# EAGLE design PR9011 (EAGLE 7.2.0)
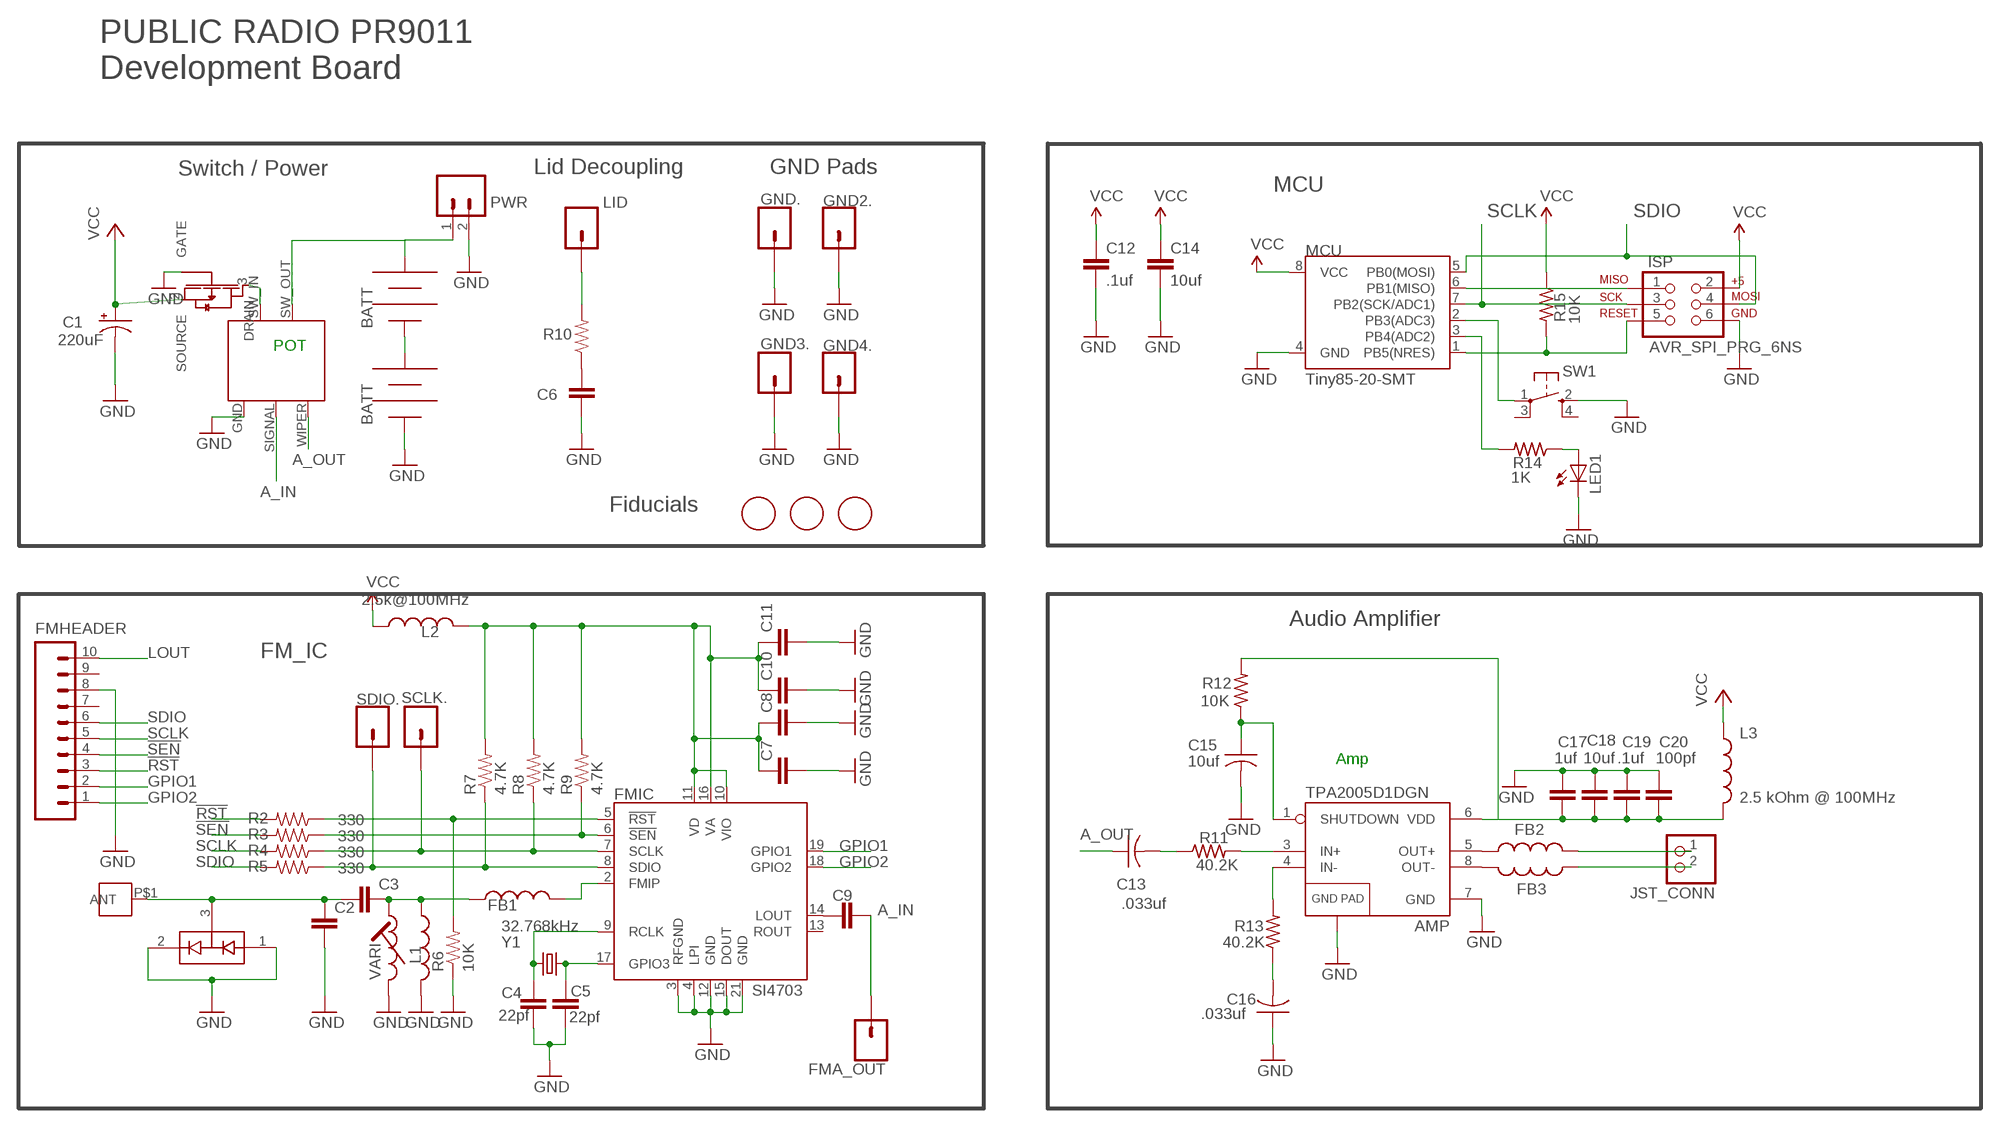
[diagram p0: schematic, sheet 1]

## Parts
AMP  TPA2005D1DGN  [POWER-SOP8]
C1  220uF  CAP_POLC  [PANASONIC_C]
C2  1.0uF  1.0UF-25V-+80/-20(0805)  [0805]
C3  1.0uF  1.0UF-25V-+80/-20(0805)  [0805]
C4  22pf  CAP0805  [0805]
C5  22pf  CAP0805  [0805]
C6  CAP0805  [0805]
C7  1.0uF  1.0UF-25V-+80/-20(0805)  [0805]
C8  .1uF  1.0UF-25V-+80/-20(0805)  [0805]
C9  1.0uF  1.0UF-25V-+80/-20(0805)  [0805]
C10  22nF  1.0UF-25V-+80/-20(0805)  [0805]
C11  4.7uF  1.0UF-25V-+80/-20(0805)  [0805]
C12  .1uf  CAP0805  [0805]
C13  .033uf  C-USC0603  [C0603]
C14  10uf  CAP0805  [0805]
C15  10uf  C-USC0603  [C0603]
C16  .033uf  C-USC0603  [C0603]
C17  1uf  CAP0805  [0805]
C18  10uf  CAP0805  [0805]
C19  .1uf  CAP0805  [0805]
C20  100pf  CAP0805  [0805]
D1  BAV99  [SOT23-3]
FB1  INDUCTOR0805  [0805]
FB2  INDUCTOR0805  [0805]
FB3  INDUCTOR0805  [0805]
FET1  SI2333DDS  [SI2333DDS]
FMA_OUT  M01PTH  [1X01]
FMHEADER  M10LOCK  [1X10_LOCK]
FMIC  SI4703  SPARKFUN_SI470X  [SPARKFUN_SI470X]
GND2.  M01PTH  [1X01]
GND3.  M01PTH  [1X01]
GND4.  M01PTH  [1X01]
GND.  M01PTH  [1X01]
ISP  AVR_SPI_PRG_6NS  [2X3-NS]
J1  M3_SCREW_POST  [M3_SCREW_POST]
JP5  BK-92_MPD_AA_BATT_CLIP  [BK-92_MPD_AA_BATT_CLIP]
JP6  BK-92_MPD_AA_BATT_CLIP  [BK-92_MPD_AA_BATT_CLIP]
JST_CONN  JST_2PIN-SMT-RA  [JST-PH-2-SMT-RA]
L1  INDUCTOR0805  [0805]
L2  2.5k@100MHz  INDUCTOR0603  [0603]
L3  2.5 kOhm @ 100MHz  INDUCTOR0603  [0603]
LED1  LEDSML0603  [SML0603]
LID  M01PTH  [1X01]
MCU  Tiny85-20-SMT  ATTINY45TINY85-20-SMT  [SO08-EIAJ]
PWR  M02PTH3  [1X02_LONGPADS]
R1  RV170SF_TAIWANA_POT_SW  [RV170SF_TAIWANA_POT_SW]
R2  330  RESISTOR0805-RES  [0805]
R3  330  RESISTOR0805-RES  [0805]
R4  330  RESISTOR0805-RES  [0805]
R5  330  RESISTOR0805-RES  [0805]
R6  10K  RESISTOR0805-RES  [0805]
R7  4.7K  RESISTOR0805-RES  [0805]
R8  4.7K  RESISTOR0805-RES  [0805]
R9  4.7K  RESISTOR0805-RES  [0805]
R10  RESISTOR0805-RES  [0805]
R11  40.2K  R-US_R0603  [R0603]
R12  10K  R-US_R0603  [R0603]
R13  40.2K  R-US_R0603  [R0603]
R14  1K  R-US_R0603  [R0603]
R15  10K  R-US_R0603  [R0603]
SCLK.  M01PTH  [1X01]
SDIO.  M01PTH  [1X01]
SW1  SPST_TACT-KMR2  [KMR2]
U$1  FIDUCIAL  [FIDUCIAL_1MM]
U$2  FIDUCIAL  [FIDUCIAL_1MM]
U$4  FIDUCIAL  [FIDUCIAL_1MM]
U$5  CE32A_FOR_JST  [CE32A_FOR_JST]  (not placed on a sheet)
VARI  L-TRIM  [146/150]
Y1  32.768kHz  CRYSTAL32-SMD  [CRYSTAL-32KHZ-SMD]

## Nets
3.3V: C7.1 C8.1 C10.1 C11.1 FMIC.10(VIO) FMIC.11(VD) FMIC.16(VA) L2.2 R7.2 R8.2 R9.2
!RST: FMHEADER.3 R2.2
!RST-L: FMIC.5(!RST) R2.1 R6.2
!SEN: FMHEADER.4 R3.2
!SEN-L: FMIC.6(!SEN) R3.1 R9.1
A_IN: C9.2 FMA_OUT.1 R1.SIGNAL
A_OUT: C13.1 R1.WIPER
GND: AMP.7(GND) AMP.9(GND) C1.- C2.2 C4.2 C5.2 C6.2 C7.2 C8.2 C10.2 C11.2 C12.2 C14.2 C15.2 C16.1 C17.1 C18.1 C19.1 C20.1 D1.1(A1) D1.2(C2) FET1.1(GATE) FMHEADER.8 FMIC.3(RFGND) FMIC.4(LPI) FMIC.12(GND) FMIC.15(DOUT) FMIC.21(GND) GND2..1 GND3..1 GND4..1 GND..1 ISP.6 JP6.NEG JP6.NEG@2(NEG) L1.2 LED1.C MCU.4(GND) PWR.2 R1.GND R6.1 SW1.2(S) VARI.P$1(START)
GPIO1: FMHEADER.2 FMIC.19(GPIO1)
GPIO2: FMHEADER.1 FMIC.18(GPIO2)
LOUT: C9.1 FMHEADER.10 FMIC.14(LOUT)
N$1: C4.1 FMIC.9(RCLK) Y1.X2
N$2: C5.1 FMIC.17(GPIO3) Y1.X1
N$3: C13.2 R11.1
N$4: AMP.3(IN+) R11.2
N$5: AMP.4(IN-) R13.2
N$6: FB1.2 FMIC.2(FMIP)
N$7: LED1.A R14.1
N$8: LID.1 R10.2
N$9: FB2.2 JST_CONN.1
N$11: MCU.2(PB3(ADC3)) SW1.1(P)
N$12: MCU.3(PB4(ADC2)) R14.2
N$13: JP5.NEG JP5.NEG@2(NEG) JP6.POS JP6.POS@2(POS)
N$14 [antenna]: C2.1 C3.1 D1.3(COM) J1.P$1(ANT)
N$15: JP5.POS JP5.POS@2(POS) PWR.1 R1.SW_OUT
N$16 [antenna]: C3.2 FB1.1 L1.1 VARI.P$2(END)
N$17: AMP.8(OUT-) FB3.2
N$18: AMP.6(VDD) C17.2 C18.2 C19.2 C20.2 L3.2 R12.2
N$19: AMP.5(OUT+) FB2.1
N$20: AMP.1(SHUTDOWN) C15.1 R12.1
N$23: C16.2 R13.1
N$34: FET1.3(DRAIN) R1.SW_IN
N$35: C6.1 R10.1
OUT-: FB3.1 JST_CONN.2
PB1: ISP.1 MCU.6(PB1(MISO))
PB5: ISP.5 MCU.1(PB5(NRES)) R15.2
SCLK: FMHEADER.5 ISP.3 MCU.7(PB2(SCK/ADC1)) R4.2
SCLK-L: FMIC.7(SCLK) R4.1 R8.1 SCLK..1
SDIO: FMHEADER.6 ISP.4 MCU.5(PB0(MOSI)) R5.2
SDIO-L: FMIC.8(SDIO) R5.1 R7.1 SDIO..1
VCC: C1.+ C12.1 C14.1 FET1.2(SOURCE) ISP.2 L2.1 L3.1 MCU.8(VCC) R15.1
Unconnected: FMHEADER.7 FMHEADER.9 FMIC.13(ROUT) SW1.3(P1) SW1.4(S1)

## Notes on the sheet
- PUBLIC RADIO PR9011
  Development Board
- Switch / Power | Lid Decoupling | GND Pads
- MCU
- POT
- Fiducials
- Audio Amplifier
- FM_IC
- Amp

## Library data of the parts
AMP = SparkFun-AnalogIC:TPA2005D1: 1.4W MONO CLASS-D AUDIO POWER AMPLIFIER The TPA2005D1 is a 1.4-W high efficiency filter-free class-D audio power amplifier in a BGA, QFN, or MSOP package that requires only three external components. Datasheet: http://focus.ti.com/lit/ds/symlink/tpa2005d1.pdf 1.4 W Into 8 ? From a 5V Supply at THD = 10% (Typ) Maximum Battery Life and Minimum Heat Efficiency With an 8-? Speaker: 84% at 400 mW, 79% at 100 mW 2.8-mA Quiescent Current 0.5-mA Shutdown Current Ideal for Wireless or Cellular Handsets and PDAs Capable of Driving an 8-? Speaker (2.5 V ? VDD ? 5.5 V) and a 4-? Speaker (2.5 V ? VDD ? 4.2 V) Only Three External Components Optimized PWM Output Stage Eliminates LC Output Filter Internally Generated 250-kHz Switching Frequency Eliminates Capacitor and Resistor Improved PSRR (-71 dB at 217 Hz) and Wide Supply Voltage (2.5 V to 5.5 V) Eliminates Need for a Voltage Regulator Fully Differential Design Reduces RF Rectification and Eliminates Bypass Capacitor Improved CMRR Eliminates Two Input Coupling Capacitors
C1 = SparkFun-Passives:CAP_POL: Capacitor Polarized These are standard SMD and PTH capacitors. Normally 10uF, 47uF, and 100uF in electrolytic and tantalum varieties. Always verify the external diameter of the through hole cap, it varies with capacity, voltage, and manufacturer. The EIA devices should be standard.
C2 C3 C7 C9 = SparkFun-Capacitors:1.0UF-25V-+80/-20(0805): CAP-11625; PROD_ID: CAP-11625
C4-C6 C12 C14 C17-C20 = SparkFun-Passives:CAP: Capacitor Standard 0603 ceramic capacitor, and 0.1" leaded capacitor.
C8 C10 C11 = SparkFun-Capacitors:1.0UF-25V-+80/-20(0805): CAP-11625; PROD_ID: CAP-11625; VALUE: 1.0uF
C13 C15 C16 = resistor:C-US: CAPACITOR, American symbol
D1 = SparkFun-DiscreteSemi:BAV99: Two small signal silicon diodes connected anode to cathode. Connections to all three nodes available. DIO-10647; PROD_ID: DIO-10647
FB1-FB3 L1-L3 = SparkFun-Passives:INDUCTOR: Inductors Basic Inductor/Choke - 0603 and 1206. Footprints are not proven and vary greatly between part numbers. SRN6045- 33uH, 20% 1.4A SDR0403-560KL - 56uH, 10%, 500mA RMS/740mA peak
FET1 = PubRadioLib:SI2333DDS
FMA_OUT GND2. GND3. GND4. GND. LID SCLK. SDIO. = SparkFun-Connectors:M01: Header 1 Standard 1-pin 0.1" header. Use with straight break away headers (SKU : PRT-00116), right angle break away headers (PRT-00553), swiss pins (PRT-00743), machine pins (PRT-00117), and female headers (PRT-00115).
FMHEADER = SparkFun-Connectors:M10: Header 10 Standard 10-pin 0.1" header. Use with straight break away headers (SKU : PRT-00116), right angle break away headers (PRT-00553), swiss pins (PRT-00743), machine pins (PRT-00117), and female headers (PRT-00115).
FMIC = FM-Meter-Driver-v11:SPARKFUN_SI470X: Description: This is a powerful FM receiver IC. Tested with Si4703. You really only need SEN, RST, SCLK, and SDIO to get a full FM radio working. Antenna comes from headphone jack. See breakout board on SparkFun website for more information.
ISP = SparkFun-Connectors:AVR_SPI_PRG_6: AVR ISP 6 Pin This is the reduced ISP connector for AVR programming. Common on Arduino. This footprint will take up less PCB space and can be used with a 10-pin to 6-pin adapter such as SKU: BOB-08508 **Special note about "TEST_POINT" package. The stop mask is on the top side, so if you want your programming test points to be on the bottom of your board, make sure to place this package on the bottom side of the board. This also ensure that the orientation to program from the bottom side will be correct.
J1 = PR_Libraries:M3_SCREW_POST
JP5 JP6 = PR_Libraries:BK-92_MPD_AA_BATT_CLIP
JST_CONN = adafruit:JST_2PIN: JST 2-Pin Connectors of various flavors SMT-RA (S2B-PH-SM4) 4UConnector #17311 SMT (B2B-PH-SM4) THM-RA (S2B-PH) THM (B2B-PH)
LED1 = led:LED: LED OSRAM: - CHIPLED LG R971, LG N971, LY N971, LG Q971, LY Q971, LO R971, LY R971 LH N974, LH R974 LS Q976, LO Q976, LY Q976 LO Q996 - Hyper CHIPLED LW Q18S LB Q993, LB Q99A, LB R99A - SideLED LS A670, LO A670, LY A670, LG A670, LP A670 LB A673, LV A673, LT A673, LW A673 LH A674 LY A675 LS A676, LA A676, LO A676, LY A676, LW A676 LS A679, LY A679, LG A679 - Hyper Micro SIDELED® LS Y876, LA Y876, LO Y876, LY Y876 LT Y87S - SmartLED LW L88C, LW L88S LB L89C, LB L89S, LG L890 LS L89K, LO L89K, LY L89K LS L896, LA L896, LO L896, LY L896 - TOPLED LS T670, LO T670, LY T670, LG T670, LP T670 LSG T670, LSP T670, LSY T670, LOP T670, LYG T670 LG T671, LOG T671, LSG T671 LB T673, LV T673, LT T673, LW T673 LH T674 LS T676, LA T676, LO T676, LY T676, LB T676, LH T676, LSB T676, LW T676 LB T67C, LV T67C, LT T67C, LS T67K, LO T67K, LY T67K, LW E67C LS E67B, LA E67B, LO E67B, LY E67B, LB E67C, LV E67C, LT E67C LW T67C LS T679, LY T679, LG T679 LS T770, LO T770, LY T770, LG T770, LP T770 LB T773, LV T773, LT T773, LW T773 LH T774 LS E675, LA E675, LY E675, LS T675 LS T776, LA T776, LO T776, LY T776, LB T776 LHGB T686 LT T68C, LB T68C - Hyper Mini TOPLED® LB M676 - Mini TOPLED Santana® LG M470 LS M47K, LO M47K, LY M47K Source: http://www.osram.convergy.de LUXEON: - LUMILED® LXK2-PW12-R00, LXK2-PW12-S00, LXK2-PW14-U00, LXK2-PW14-V00 LXK2-PM12-R00, LXK2-PM12-S00, LXK2-PM14-U00 LXK2-PE12-Q00, LXK2-PE12-R00, LXK2-PE12-S00, LXK2-PE14-T00, LXK2-PE14-U00 LXK2-PB12-K00, LXK2-PB12-L00, LXK2-PB12-M00, LXK2-PB14-N00, LXK2-PB14-P00, LXK2-PB14-Q00 LXK2-PR12-L00, LXK2-PR12-M00, LXK2-PR14-Q00, LXK2-PR14-R00 LXK2-PD12-Q00, LXK2-PD12-R00, LXK2-PD12-S00 LXK2-PH12-R00, LXK2-PH12-S00 LXK2-PL12-P00, LXK2-PL12-Q00, LXK2-PL12-R00 Source: www.luxeon.com KINGBRIGHT: KA-3528ASYC Source: www.kingbright.com
MCU = SparkFun-DigitalIC:ATTINY45: Atmel 8-pin 2/4/8kB flash uC; PROD_ID: IC-09092
PWR = SparkFun-Connectors:M02: Standard 2-pin 0.1" header. Use with - straight break away headers ( PRT-00116) - right angle break away headers (PRT-00553) - swiss pins (PRT-00743) - machine pins (PRT-00117) - female headers (PRT-00115) Molex polarized connector foot print use with: PRT-08233 with associated crimp pins and housings. 2.54_SCREWTERM for use with PRT-10571. 3.5mm Screw Terminal footprints for PRT-08084 5mm Screw Terminal footprints for use with PRT-08432
R1 = PR_Libraries:RV170SF_TAIWANA_POT_SW
R2-R10 = SparkFun-Passives:RESISTOR: Resistor Basic schematic elements and footprints for 0603, 1206, and PTH resistors.
R11-R15 = resistor:R-US_: RESISTOR, American symbol
SW1 = adafruit:SPST_TACT: SMT 6mm switch, EVQQ2 series http://www.ladyada.net/library/eagle
U$1 U$2 U$4 = adafruit:FIDUCIAL: For use by pick and place machines to calibrate the vision/machine, 1mm By microbuilder.eu
U$5 = PR_Libraries:CE32A_FOR_JST
VARI = coilcraft-trimmer:L-TRIM: Coilcraft 146/150 series trimmer
Y1 = SparkFun:CRYSTAL: Crystals Various standard crystals. Proven footprints. Spark Fun Electronics SKU : COM-00534

## Net classes
1 antenna: clearance 1.27 mm

## Board
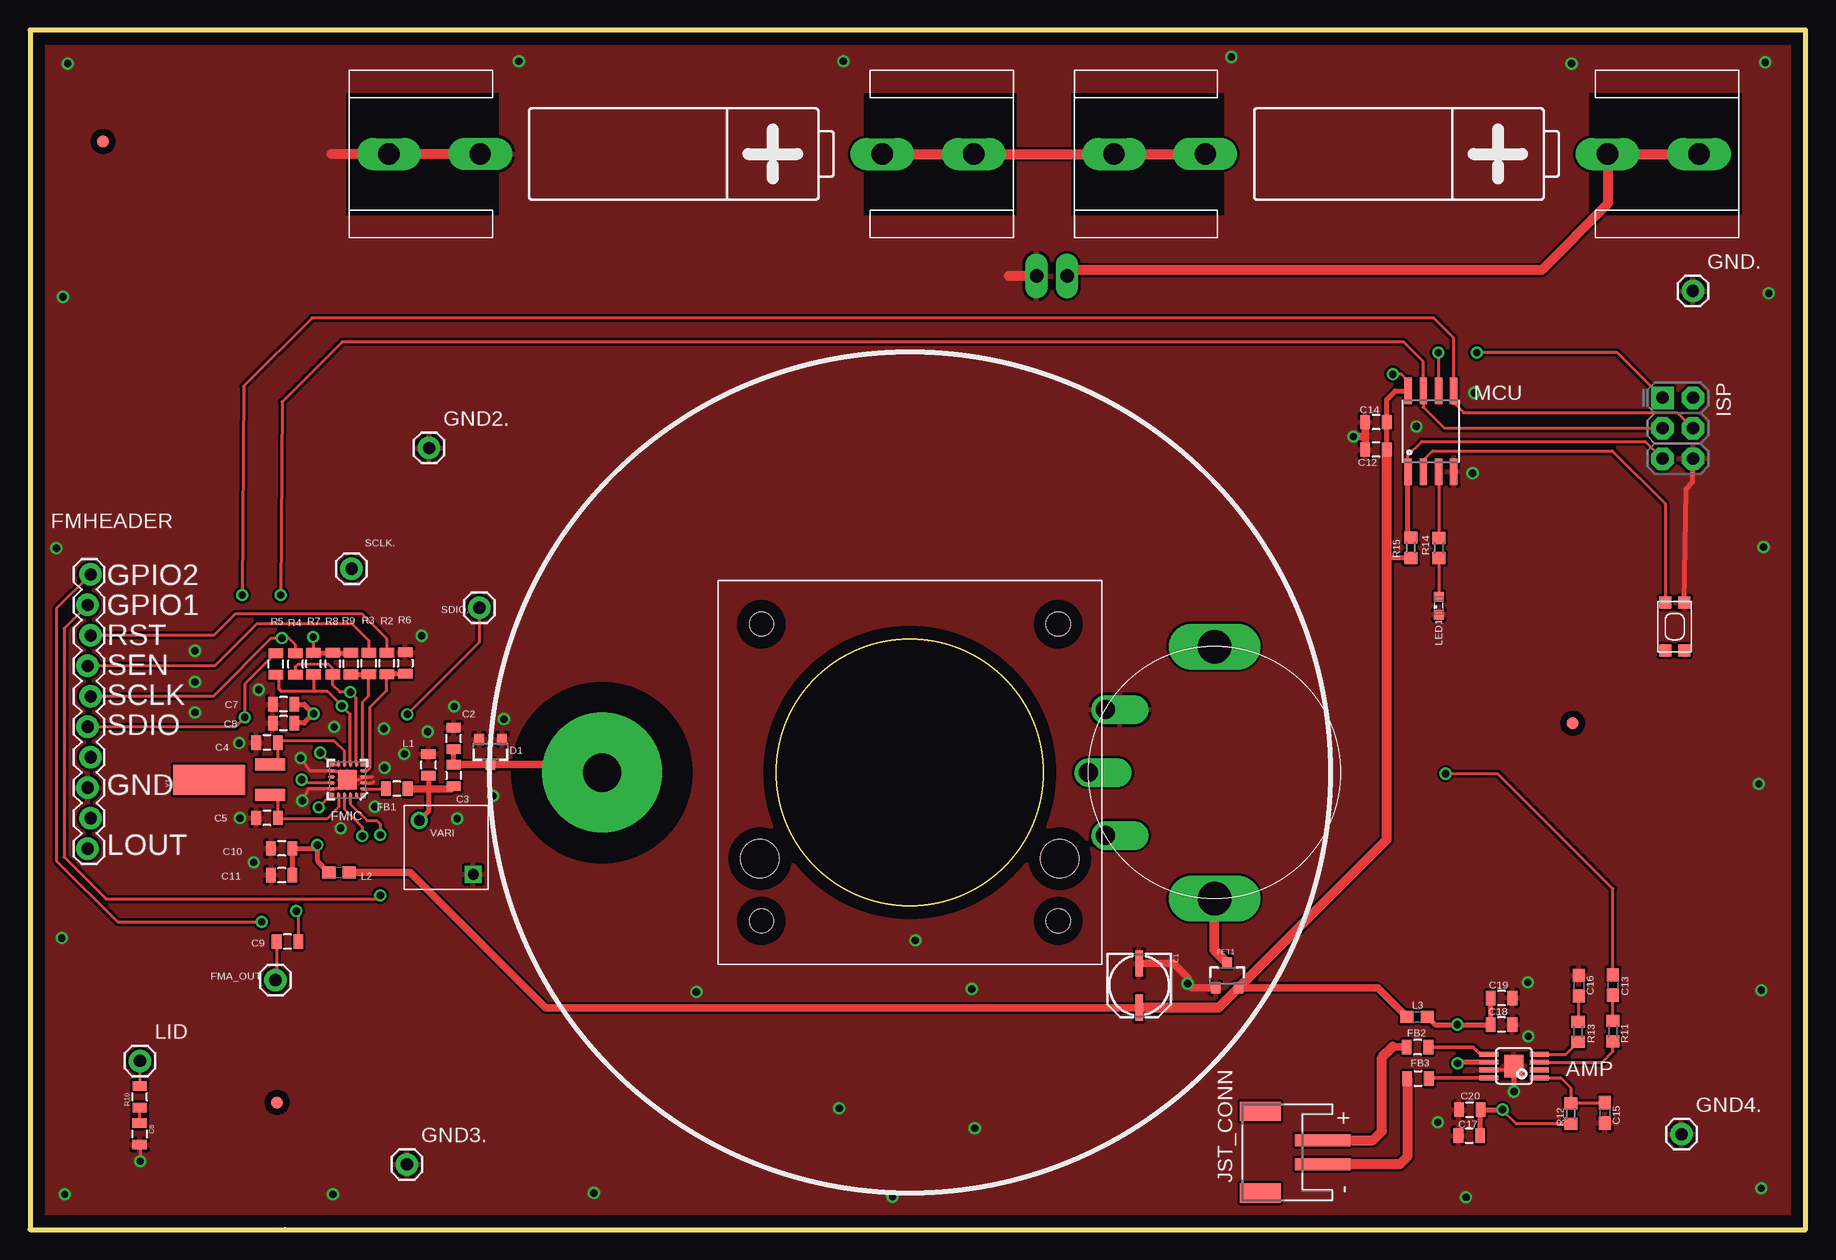
[diagram p1: board, top side]
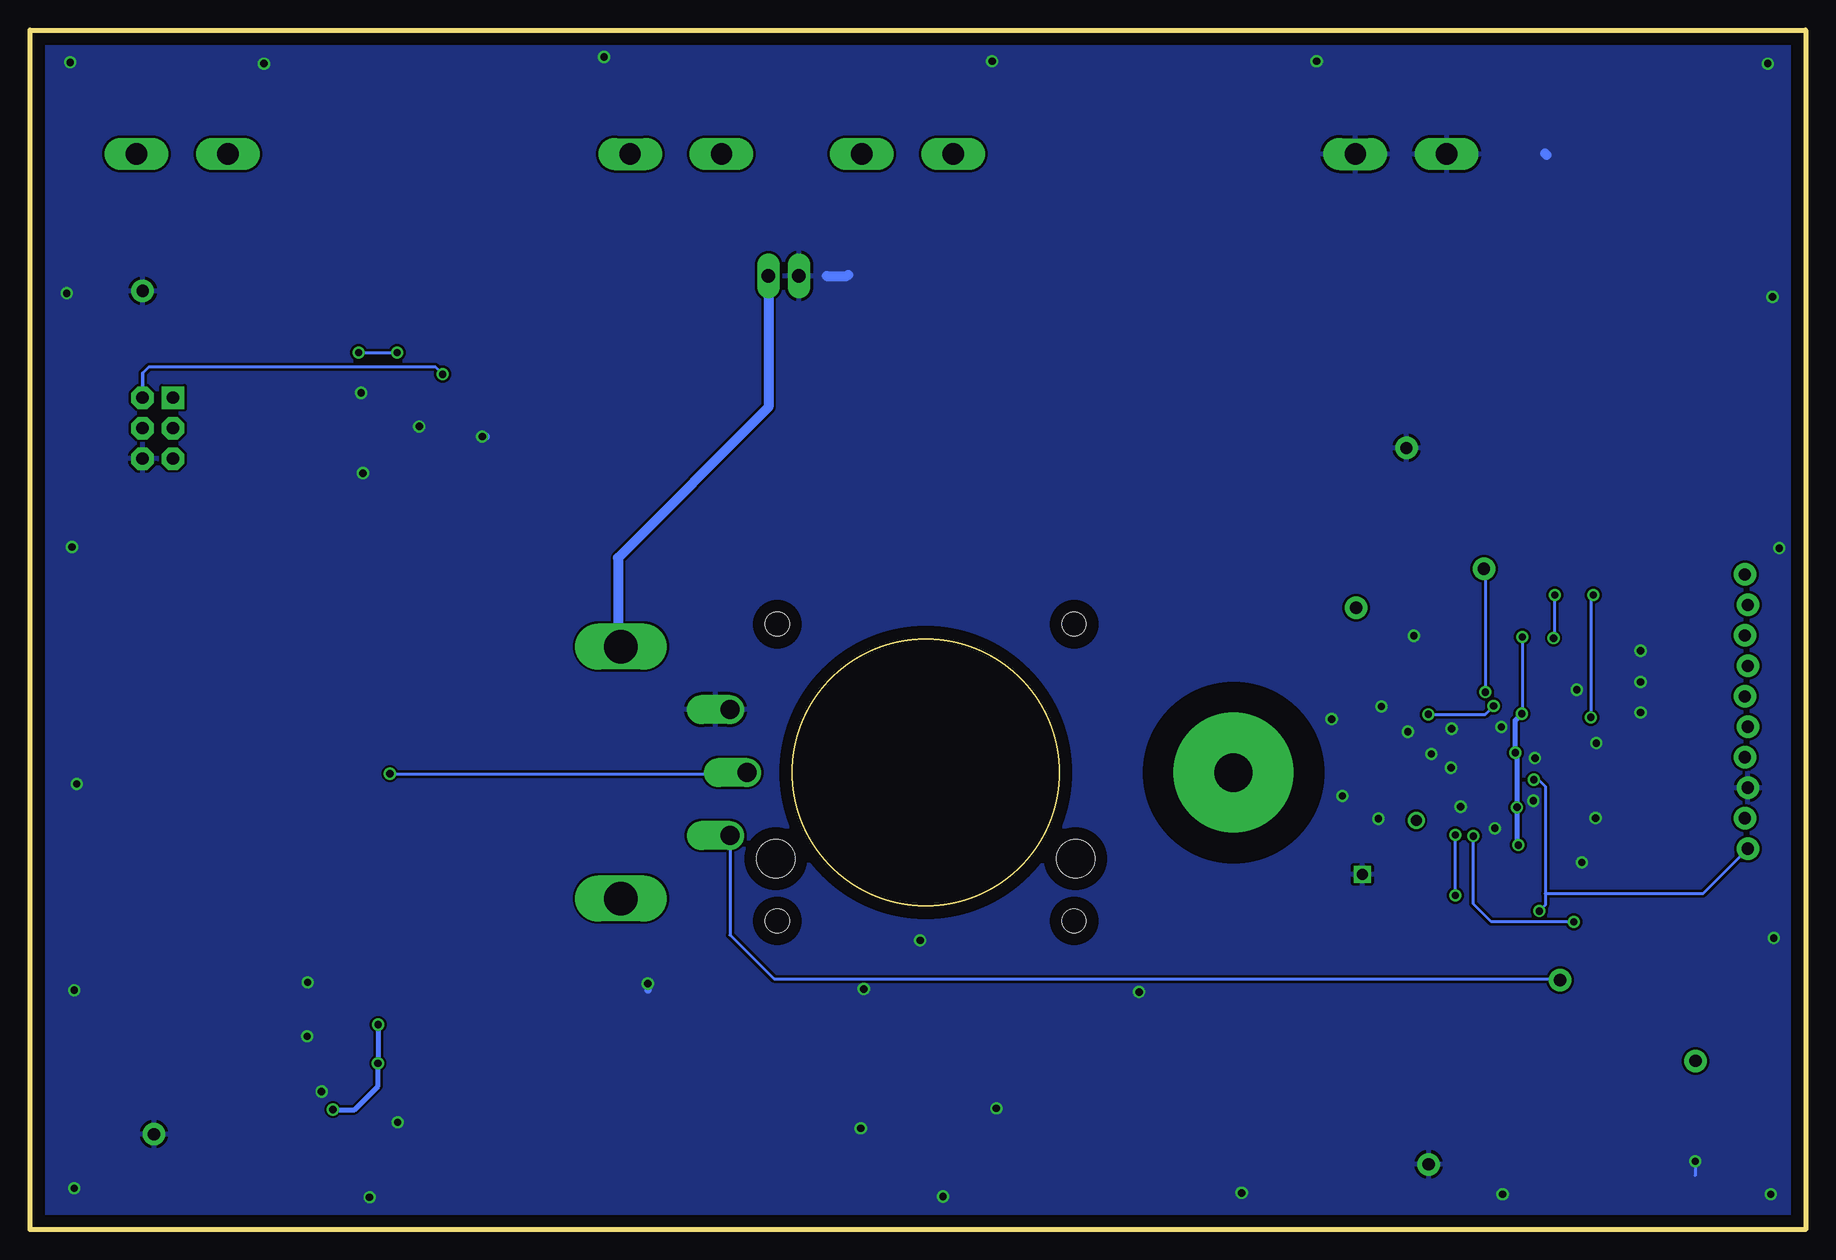
[diagram p2: board, bottom side, seen from below]

Size 148 x 100 mm. Coordinates in mm from the lower left corner, seen from the top.
Outline: 21.27,0 91.55,0
Outline: 21.27,0 0,0 0,100 148,100 148,0 21.27,0
Copper layers (1*16): Top 0.035mm / dielectric 1.5mm / Bottom 0.035mm
Design rules "default *": minimum track width 10mil, minimum drill 0.6mm, track to track 8mil, track to pad 8mil, pad to pad 8mil, via to via 8mil, smd to smd 8mil, copper to edge 40mil, drill to drill 8mil, minimum pad ring 10mil, minimum via ring 8mil, stop-mask expansion 4mil, vias tented up to drill 0mil, thermal gap 10mil

### Footprints (pad centres in the part's own frame; a part is rotated, then mirrored left to right if it is on the bottom)
POWER-SOP8 = smd 0.4 x 1.6: 1 -0.975,-2.1; 2 -0.325,-2.1; 3 0.325,-2.1; 4 0.975,-2.1; 5 0.975,2.1; 6 0.325,2.1; 7 -0.325,2.1; 8 -0.975,2.1 | smd 1.89 x 1.57: 9 0,0
PANASONIC_C = smd 2.2 x 0.65: + 1.9,-0.2; - -1.8,-0.2
0805 = smd 0.8 x 1.2: 1 -0.9,0; 2 0.9,0
C0603 = smd 1.1 x 1: 1 -0.85,0; 2 0.85,0
SOT23-3 = smd 0.8 x 0.9: 1 -0.95,-1; 2 0.95,-1; 3 0,1.1
SI2333DDS = smd 0.8 x 0.9: 1 -0.95,-1; 2 0.95,-1; 3 0,1.1
1X01 = drill 1.016 pad 1.88: 1 0,0
1X10_LOCK = drill 1.016 pad 1.88: 1 0,0.127; 2 2.54,-0.127; 3 5.08,0.127; 4 7.62,-0.127; 5 10.16,0.127; 6 12.7,-0.127; 7 15.24,0.127; 8 17.78,-0.127; 9 20.32,0.127; 10 22.86,-0.127
SPARKFUN_SI470X = smd 0.34 x 0.34: 1 -1.275,1.265; 6 -1.265,-1.265; 11 1.265,-1.265; 16 1.265,1.265 | smd 0.61 x 0.28: 2 -1.335,0.75; 3 -1.335,0.25; 4 -1.335,-0.25; 5 -1.335,-0.75; 12 1.335,-0.75; 13 1.335,-0.25; 14 1.335,0.25; 15 1.335,0.75 | smd 0.28 x 0.61: 7 -0.75,-1.335; 8 -0.25,-1.335; 9 0.25,-1.335; 10 0.75,-1.335; 17 0.75,1.335; 18 0.25,1.335; 19 -0.25,1.335; 20 -0.75,1.335 | smd 1.6 x 1.6: 21 0,0
2X3-NS = drill 1.016 pad 1.88 square: 1 -2.54,-1.27 | drill 1.016 pad 1.88 octagon: 2 -2.54,1.27; 3 0,-1.27; 4 0,1.27; 5 2.54,-1.27; 6 2.54,1.27
M3_SCREW_POST = drill 3.2 pad 10: P$1 0,0
BK-92_MPD_AA_BATT_CLIP = drill 1.778 long: NEG -24.384,0; NEG@2 -16.764,0; POS 16.764,0; POS@2 24.384,0
JST-PH-2-SMT-RA = smd 1 x 4.6: 1 1,-3.7; 2 -1,-3.7 | smd 1.6 x 3.4: NC1 -3.4,1.5; NC2 3.4,1.5
0603 = smd 1.1 x 1: 1 -0.85,0; 2 0.85,0
SML0603 = smd 0.8 x 0.8: A 0.75,0; C -0.75,0
SO08-EIAJ = smd 0.61 x 2.21: 1 -1.905,-3.378; 2 -0.635,-3.378; 3 0.635,-3.378; 4 1.905,-3.378; 5 1.905,3.353; 6 0.635,3.353; 7 -0.635,3.353; 8 -1.905,3.353
1X02_LONGPADS = drill 1.118 pad 1.88 long: 1 0,0; 2 2.54,0
RV170SF_TAIWANA_POT_SW = drill 1.6 offset: GND -5.25,-9.09; SIGNAL 5.25,-9.09; WIPER 0,-10.5 | drill 2.8 long: SW_IN 10.5,0; SW_OUT -10.5,0
R0603 = smd 1 x 1.1: 1 -0.85,0; 2 0.85,0
KMR2 = smd 1 x 1: 1 2,0.8; 2 2,-0.8; 3 -2,0.8; 4 -2,-0.8
FIDUCIAL_1MM = smd 1 x 1: 1 0,0
CE32A_FOR_JST = hole 2: -12.37,12.37; 12.37,12.37; 12.37,-12.37; -12.37,-12.37 | hole 3.2: -12.497,-7.188; 12.497,-7.188
146/150 = drill 0.9 square: P$1 -2.25,2.25 | drill 0.9: P$2 2.25,-2.25
CRYSTAL-32KHZ-SMD = smd 2.5 x 6: SHEILD 0,5.08 | smd 1 x 2.5: X1 -1.27,0; X2 1.27,0

### Placement (x,y rotation side)
AMP  123.7,13.63 90 top
C1  92.65,20.39 270 top
C2  35.31,40.94 90 top
C3  35.32,37.86 270 top
C4  19.75,40.59 180 top
C5  19.75,34.31 180 top
C6  9.13,7.97 270 top
C7  21.14,43.79 180 top
C8  21.14,42.21 180 top
C9  21.46,24 180 top
C10  20.99,31.77 180 top
C11  20.99,29.54 180 top
C12  112.2,65.02 180 top
C13  131.94,20.39 270 top
C14  112.2,67.31 180 top
C15  131.27,9.73 270 top
C16  129.09,20.34 270 top
C17  119.96,7.83 0 top
C18  122.67,17.08 180 top
C19  122.67,19.29 180 top
C20  120.01,9.99 0 top
D1  38.39,39.86 180 top
FB1  30.58,36.75 180 top
FB2  115.66,15.2 180 top
FB3  115.7,12.6 0 top
FET1  99.79,21.14 0 top
FMA_OUT  20.46,20.8 270 top
FMHEADER  4.93,54.61 270 top
FMIC  26.47,37.49 180 top
GND2.  33.26,65.16 0 top
GND3.  31.41,5.43 0 top
GND4.  137.66,7.95 0 top
GND.  138.61,78.24 0 top
ISP  137.35,66.8 270 top
J1  47.69,38.1 0 top
JP5  114.74,89.66 0 top
JP6  54.29,89.66 0 top
JST_CONN  104.05,6.45 90 top
L1  33.21,38.73 90 top
L2  25.77,29.76 180 top
L3  115.62,17.72 0 top
LED1  117.44,52.01 90 top
LID  9.17,14.05 0 top
MCU  116.77,66.55 0 top
PWR  86.45,79.49 180 top
R1  98.74,38.1 270 top
R2  29.74,47.2 90 top
R3  28.23,47.2 90 top
R4  22.14,47.15 90 top
R5  20.49,47.15 90 top
R6  31.29,47.22 270 top
R7  23.64,47.17 90 top
R8  25.24,47.17 90 top
R9  26.73,47.17 90 top
R10  9.15,11.07 90 top
R11  131.94,16.53 270 top
R12  128.43,9.66 270 top
R13  129.04,16.48 270 top
R14  117.44,56.81 90 top
R15  115.1,56.85 90 top
SCLK.  26.81,55.09 0 top
SDIO.  37.46,51.84 0 top
SW1  137.09,50.27 90 top
U$1  128.6,42.2 0 top
U$2  6.1,90.7 0 top
U$4  20.6,10.6 0 top
U$5  73.34,38.1 0 top
VARI  34.7,31.85 180 top
Y1  20,37.49 90 top

### Tracks (layer width: path | path; a pad name or v marks a point on that pad's centre or on a via)
3.3V  (via drill 0.6)
  Top 0.254: FMIC.10 25.65,38.76 FMIC.11 v24.21,39.75 v24.2,39.75 | FMIC.16 25.07,36.23 v24.05,35.2 | R7.2 23.64,49.36 v23.6,49.4 | 23.67,31.77 v23.95,32.05
  Top 0.406: R7.2 R8.2 R9.2 | v23.95,32.05 23.95,30.73 L2.2 | C8.1 22.86,42.21 v23.65,43 22.86,43.79 C7.1 | C11.1 C10.1 23.67,31.77
  Bottom 0.254: 24.05,32.15 v23.95,32.05 | v23.6,49.4 23.6,43.05 v23.65,43
  Bottom 0.406: 24.05,32.15 v24.05,35.2 24.05,39.6 v24.2,39.75 24.2,42.45 v23.65,43
!RST
  Top 0.254: FMHEADER.3 15.33,49.53 17.1,51.3 27.7,51.3 29.74,49.26 R2.2
!RST-L
  Top 0.254: FMIC.5 28.09,38.24 28.35,38.5 28.35,43.55 29.74,44.94 R2.1 29.75,46.32
  Top 0.406: R6.2 29.75,46.32
!SEN
  Top 0.254: FMHEADER.4 15.39,46.99 18.9,50.5 26.85,50.5 28.23,49.12 R3.2 28.2,48.13
!SEN-L
  Top 0.254: 28.2,46.27 R3.1 | 28.33,46.2 R3.1 | FMIC.6 27.73,43.98 28.23,44.48 R3.1
  Top 0.406: R9.1 28.2,46.27
A_IN
  Top 0.254: C9.2 20.56,20.9 FMA_OUT.1
  Bottom 0.254: R1.SIGNAL 89.65,24.55 86,20.9 20.56,20.9 FMA_OUT.1
A_OUT  (via drill 0.6)
  Top 0.254: C13.1 131.94,28.41 122.35,38 v118,38
  Bottom 0.254: v118,38 87.8,38
  Bottom 0.61: 87.8,38 87.7,38.1 R1.WIPER
GND  (via drill 0.6)
  Top 0.254: C6.2 9.2,7 v9.2,5.7 | v22.7,35.75 23.19,36.74 FMIC.15 arc30 26.1,37 | v22.55,39.3 23.31,38.24 FMIC.12 arc-21 25.9,38.1 arc-54 26.45,37.5 | FMIC.21 27.55,37.49 FMIC.4 27.81,37.75 28.55,37.75 | FMIC.3 28.54,37.24 arc90 28.65,37.35
  Top 0.305: AMP.7 123.38,13.31 AMP.9
  Top 0.406: AMP.9 v123.7,11.5 | SW1.2 138.04,61.74 138.6,62.3 138.6,64.24 ISP.6
  Top 0.61: C1.- 95.31,22.19 96.5,21 v96.5,20.5 96.86,20.14 FET1.1 | C14.2 C12.2 111.3,65.9 111.1,66.1 v110.3,66.1
  Top 0.813: 29.34,89.66 JP6.NEG@2 25.14,89.66 | PWR.2 81.61,79.49 81.6,79.5
  Bottom 0.254: v9.2,5.7 9.2,4.5 | v22.7,35.75 22.65,36.05 | v22.55,39.3 22.7,39
  Bottom 0.406: v123.7,11.5 123.7,11.4 123.8,11.8
  Bottom 0.61: v96.5,20.5 96.5,20 | v110.3,66.1 110,66.1
  Bottom 0.813: 21.7,89.7 21.6,89.6 | 81.6,79.5 79.9,79.5 79.8,79.6
  other vias: 124.9,16.1 117.35,8.95 35.35,43.6 124.85,20.6 17.5,34.3 17.45,40.55 32.65,49.5 29.55,38.5 29.5,41.75 31.2,39.65 33.15,41.5 38.6,36.15 39.5,42.55 25.9,33.45 18.65,30.6 19.05,45 25.35,41.9 28.75,35.25 35.6,34.25 13.75,43.1 13.75,45.65 13.75,48.25 120.25,63.05 115.55,66.95 120.4,69.75 73.8,24.1 78.5,20.05 78.75,8.45 55.55,19.8 71.9,2.75 67.45,10.1 2.9,2.95 25.25,2.95 47,3.05 2.65,24.3 2.2,56.8 2.75,77.75 3.15,97.2 40.75,97.4 67.8,97.4 100.15,97.75 128.5,97.2 144.65,97.3 144.95,78.05 144.5,56.9 144.1,37.15 144.3,19.95 144.3,3.45 119.7,2.7
  pour Bottom: 148,0 148,100 0,100 0,0
  pour Top: 148,0 148,100 0,100 0,0
GPIO1  (via drill 0.6)
  Top 0.254: FMIC.19 26.7,36.14 26.7,35.5 28.1,34.1 28.9,34.1 29.2,33.8 v29.2,32.9 | FMHEADER.2 2.85,50.12 2.85,31.05 6.35,27.55 28.9,27.55 v29.2,27.85
  Bottom 0.254: v29.2,27.85 v29.2,32.9
GPIO2  (via drill 0.6)
  Top 0.254: FMIC.18 26.2,36.14 26.2,35.05 27.7,33.55 v27.7,32.8 | FMHEADER.1 2.2,51.76 2.2,30.75 7.3,25.65 v19.3,25.65
  Bottom 0.254: v19.3,25.65 26.2,25.65 27.7,27.15 v27.7,32.8
LOUT  (via drill 0.6)
  Top 0.254: FMIC.14 22.91,37.24 v22.65,37.5 | v22.2,26.55 22.36,26.39 C9.1
  Bottom 0.254: v22.65,37.5 22.25,37.5 21.7,36.95 21.7,28 | 21.7,28 21.7,27.05 v22.2,26.55 | FMHEADER.10 8.55,28 21.7,28
N$1
  Top 0.254: FMIC.9 26.22,39.88 25.35,40.75 20.65,40.75 C4.1 20.65,38.76 Y1.X2
N$2
  Top 0.254: Y1.X1 20.65,36.22 C5.1 20.71,34.25 24.75,34.25 25.72,35.22 FMIC.17
N$3
  Top 0.254: R11.1 C13.2
N$4
  Top 0.254: AMP.3 131.06,13.96 131.94,14.84 R11.2
N$5
  Top 0.254: AMP.4 128.02,14.61 R13.2
N$6
  Top 0.254: FMIC.2 27.81,36.75 FB1.2
N$7
  Top 0.254: R14.1 LED1.A
N$8
  Top 0.254: R10.2 9.17,11.99 LID.1
N$9
  Top 0.61: JST_CONN.1 108.3,7.45 108.25,7.4 | 113.6,15.25 114.71,15.25 FB2.2
  Top 0.813: 108.3,7.45 111.95,7.45 112.7,8.2 112.7,14.35 113.6,15.25
N$11
  Top 0.254: MCU.2 116.14,64.14 116.9,64.9 131.9,64.9 136.29,60.51 SW1.1
N$12
  Top 0.254: MCU.3 117.44,63.14 R14.2
N$13
  Top 0.813: JP6.POS JP6.POS@2 JP5.NEG JP5.NEG@2
N$14
  Top 0.254: C2.1 arc90 C2.1
  Top 0.406: 47.67,38.11 arc-90 J1.P$1 | C3.1 C2.1
  Top 0.61: C3.1 D1.3 47.02,38.76 J1.P$1
N$15
  Top 0.813: JP5.POS@2 JP5.POS 131.51,85.51 126,80 86.96,80 PWR.1
  Bottom 0.813: PWR.1 86.45,68.55 99,56 99,48.86 R1.SW_OUT
N$16
  Top 0.406: 35.11,36.75 C3.2 | VARI.P$2 33.21,34.86 L1.1 33.21,36.79 33.25,36.75
  Top 0.61: FB1.1 33.25,36.75 35.11,36.75
N$17
  Top 0.305: AMP.8 116.71,12.66 116.65,12.6
  Top 0.406: 116.65,12.6 FB3.2
N$18  (via drill 0.6)
  Top 0.254: R12.2 123.89,8.81 122.71,9.99 C20.2
  Top 0.406: L3.2 117.11,17.08 v118.98,17.08 C18.2 C19.2 | C17.2 120.86,9.94 C20.2 v122.75,9.99 v122.75,10 | AMP.6 119,13.96 v119,13.85
  Bottom 0.406: v119,13.85 119.1,13.85 | v122.75,10 120.95,10 119,11.95 v119,13.85 | v118.98,17.08 118.98,13.85 v119,13.85
N$19
  Top 0.254: AMP.5 120.89,14.61
  Top 0.305: 120.89,14.61 120.3,15.2 116.61,15.2
  Top 0.406: 116.61,15.2 FB2.1
N$20
  Top 0.254: AMP.1 127.59,12.66 128.43,11.82 R12.1 128.5,10.58 C15.1
N$23
  Top 0.254: R13.1 129.09,17.38 C16.2
N$34
  Top 0.813: FET1.3 98.74,23.29 R1.SW_IN
N$35
  Top 0.254: C6.1 9.15,8.88 R10.1
OUT-
  Top 0.813: FB3.1 114.8,6.05 114.2,5.45 JST_CONN.2
PB1  (via drill 0.6)
  Top 0.254: ISP.1 132.32,73.1 v120.6,73.1 | v117.41,73.09 MCU.6
  Top 0.406: MCU.6 | v117.4,73.1 v117.41,73.09
  Bottom 0.254: v120.6,73.1 v117.4,73.1
PB5
  Top 0.254: MCU.1 114.87,64.57 116,65.7 134.64,65.7 ISP.5
  Top 0.406: R15.2 114.87,57.7 MCU.1
SCLK  (via drill 0.6)
  Top 0.254: ISP.3 117.9,66.8 116.14,68.56 MCU.7 116.14,72.36 114.5,74 26,74 21,69 v20.9,52.9 | FMHEADER.5 15.25,44.45 20.1,49.3 v21,49.3 21.55,49.3 22.14,48.71 R4.2
  Top 0.406: ISP.3
  Bottom 0.254: v21,49.3 20.9,49.8 v20.9,52.9
SCLK-L  (via drill 0.6)
  Top 0.254: FMIC.7 27.2,38.84 27.2,44.3 v26.7,44.8 25.85,44.8 25.24,45.41 R8.1 | R8.1 25.24,46.76 24.9,47.1 22.3,47.1 22.1,46.9 22.1,46.29 R4.1 | 25.34,46.17 R8.1
  Bottom 0.254: SCLK..1 26.7,54.98 v26.7,44.8
SDIO  (via drill 0.6)
  Top 0.254: MCU.5 118.68,74.32 117,76 23.5,76 17.8,70.3 v17.7,52.9 | 118.68,68.92 119.5,68.1 137.32,68.1 ISP.4 | v17.9,42.7 17.11,41.91 FMHEADER.6 | 20.44,48 R5.2 17.9,45.46 v17.9,42.7 | v17.9,42.7 17.79,42.6
  Top 0.406: MCU.5 118.68,68.92
  Bottom 0.254: v17.7,52.9 17.9,52.7 v17.9,42.7
SDIO-L  (via drill 0.6)
  Top 0.254: FMIC.8 26.7,38.84 26.7,42.95 v26,43.65 25.62,44.02 24.8,44.85 23.7,44.85 | 23.7,44.85 20.95,44.85 20.75,45.05 20.75,45.99 R5.1 | R7.1 23.64,44.91 23.7,44.85 | SDIO..1 37.46,48.96 v31.45,42.95
  Bottom 0.254: v31.45,42.95 26.7,42.95 v26,43.65
VCC  (via drill 0.6)
  Top 0.254: MCU.8 | 114.9,70.7 114.3,71.3 v113.6,71.3
  Top 0.406: C12.1 C14.1 113.1,69.2 113.8,69.9 MCU.8 114.9,69.93 114.9,70.7 | 100.72,20.13 FET1.2 | R15.1 113.1,56
  Top 0.61: L3.1 112.35,20.14 FET1.2 | L2.1 31.69,29.76 42.96,18.49 C1.+
  Top 0.813: C1.+ 99.08,18.49 FET1.2 113.1,32.51 113.1,56 C12.1
  Bottom 0.254: v113.6,71.3 114.2,71.9 138.1,71.9 138.62,71.38
  Bottom 0.305: 138.62,71.38 ISP.2

### Text on the board
tNames: GPIO2 | GPIO1 | RST | SEN | SCLK | SDIO | GND | VARI | LOUT